# EAGLE schematic tinyduino-breakout-mk-5.1 (EAGLE 7.5.0)
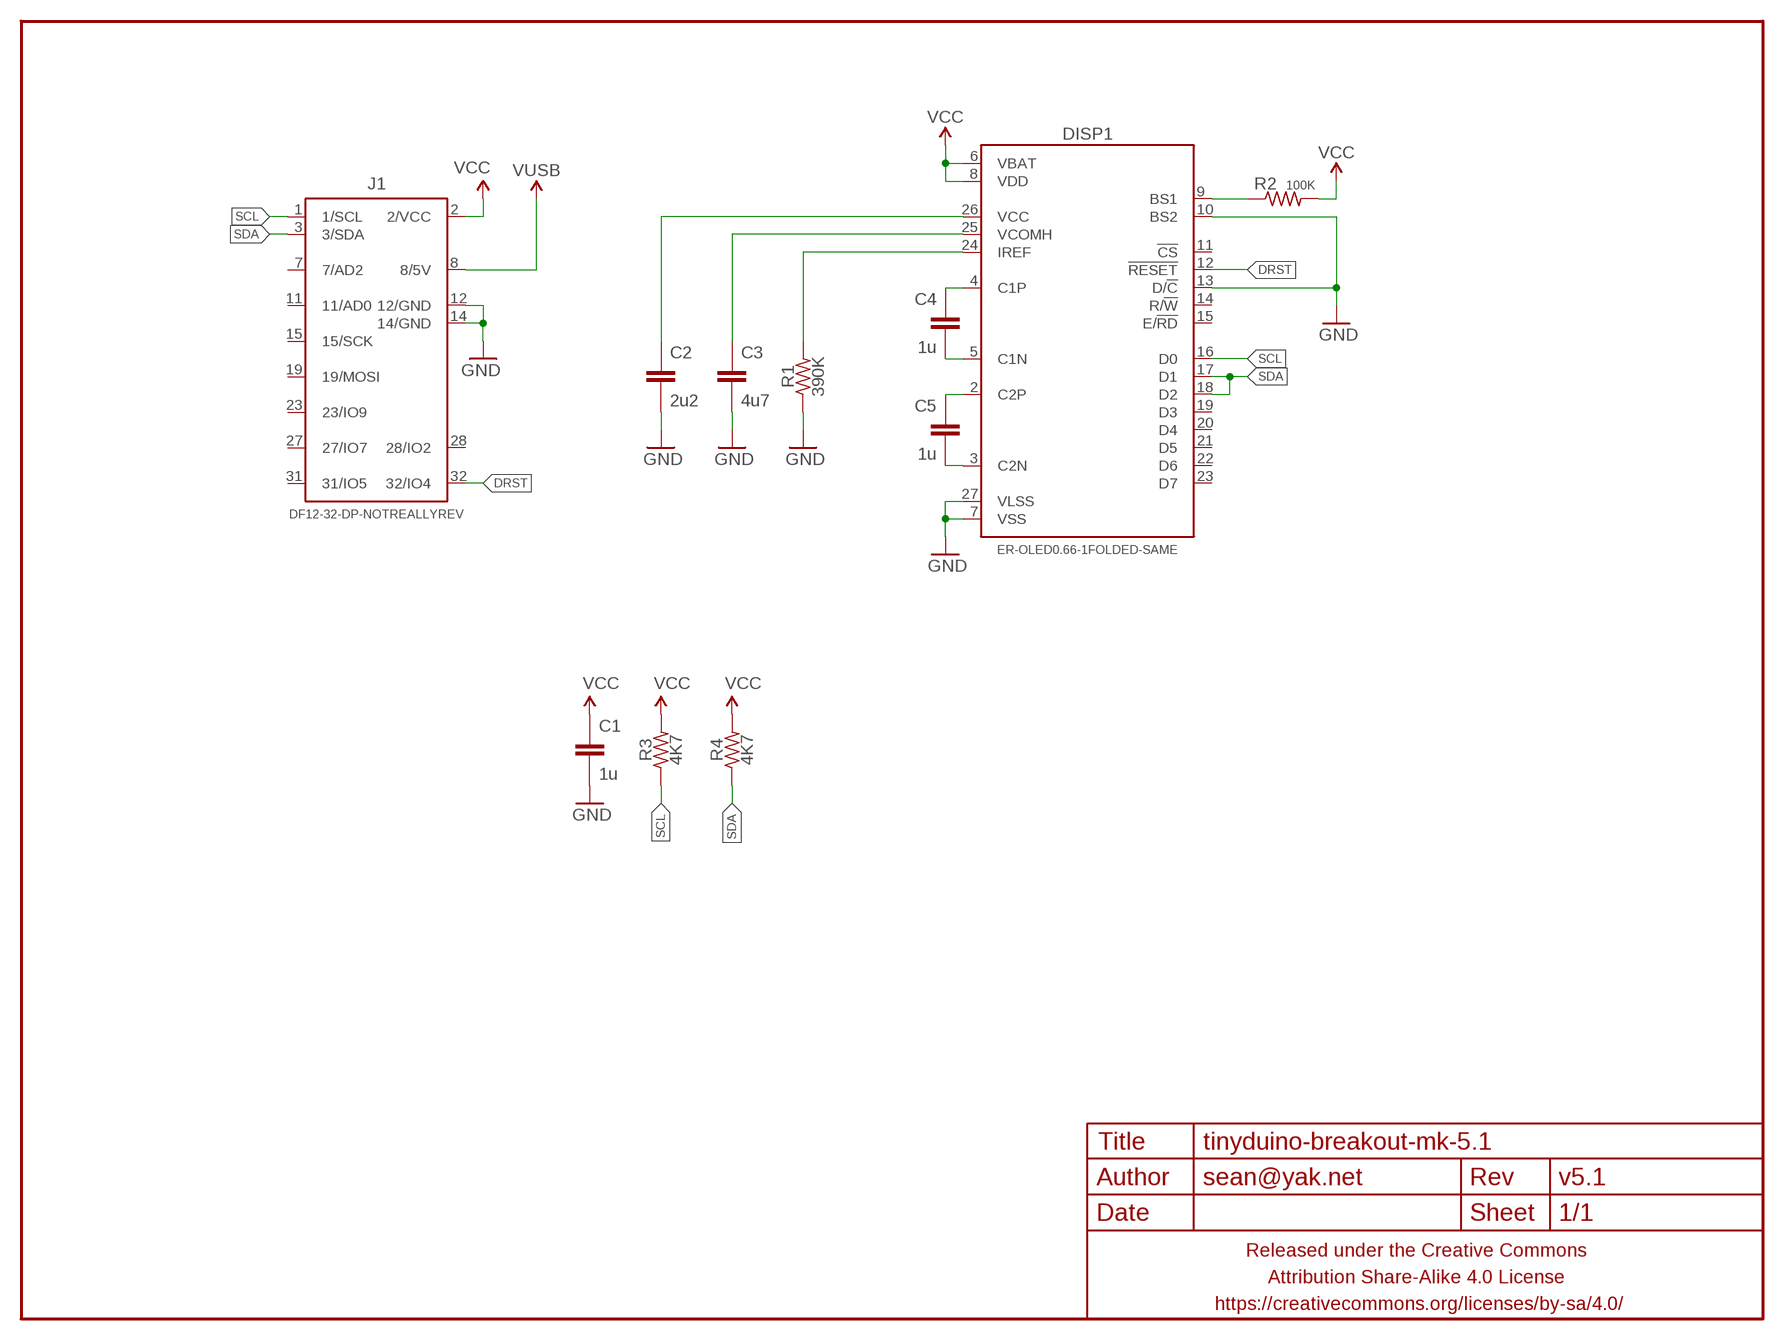
[diagram p0: schematic, sheet 1]

## Parts
C1  1u  CAPACITOR-CERAMICC0603  [C0603]
C2  2u2  CAPACITOR-CERAMICC0603  [C0603]
C3  4u7  CAPACITOR-CERAMICC0603  [C0603]
C4  1u  CAPACITOR-CERAMICC0603  [C0603]
C5  1u  CAPACITOR-CERAMICC0603  [C0603]
DISP1  ER-OLED0.66-1FOLDED-SAME  [ER-OLED0.66-1-FOLDED-SAME]
FRAME1  FRAME-LETTERNO_PACKAGE  [DUMMY]
J1  DF12-32-DP-NOTREALLYREV  [DF12-32-DP-I2C+EXTRA-REV]
R1  390K  RESISTORR0603  [R0603]
R2  100K  RESISTORR0603  [R0603]
R3  4K7  RESISTORR0603  [R0603]
R4  4K7  RESISTORR0603  [R0603]

## Nets
DRST: DISP1.12(!RESET) J1.32(32/IO4)
GND: C1.2 C2.2 C3.2 DISP1.7(VSS) DISP1.10(BS2) DISP1.13(D/!C) DISP1.27(VLSS) J1.12(12/GND) J1.14(14/GND) R1.1
N$1: C2.1 DISP1.26(VCC)
N$2: C3.1 DISP1.25(VCOMH)
N$3: DISP1.24(IREF) R1.2
N$4: C4.1 DISP1.4(C1P)
N$5: C4.2 DISP1.5(C1N)
N$6: C5.1 DISP1.2(C2P)
N$7: C5.2 DISP1.3(C2N)
N$9: DISP1.9(BS1) R2.1
SCL: DISP1.16(D0) J1.1(1/SCL) R3.1
SDA: DISP1.17(D1) DISP1.18(D2) J1.3(3/SDA) R4.1
VCC: C1.1 DISP1.6(VBAT) DISP1.8(VDD) J1.2(2/VCC) R2.2 R3.2 R4.2
VUSB: J1.8(8/5V)
Unconnected: DISP1.11(!CS) DISP1.14(R/!W) DISP1.15(E/!RD) DISP1.19(D3) DISP1.20(D4) DISP1.21(D5) DISP1.22(D6) DISP1.23(D7) J1.7(7/AD2) J1.11(11/AD0) J1.15(15/SCK) J1.19(19/MOSI) J1.23(23/IO9) J1.27(27/IO7) J1.28(28/IO2) J1.31(31/IO5)

## Library data of the parts
C1-C5 = a_parts:CAPACITOR-CERAMIC: CAPACITOR, European symbol
DISP1 = a_parts:ER-OLED0.66-1
FRAME1 = A_butts:FRAME-LETTER: Schematic Frame Standard 8.5x11 US Letter frame; DESIGNER: sean@yak.net; VERSION: v5.1
J1 = a_parts:DF12-32-DP-NOTREALLY
R1-R4 = a_parts:RESISTOR: RESISTOR, American symbol